# Altium schematic sheet MS.SchDoc
size E
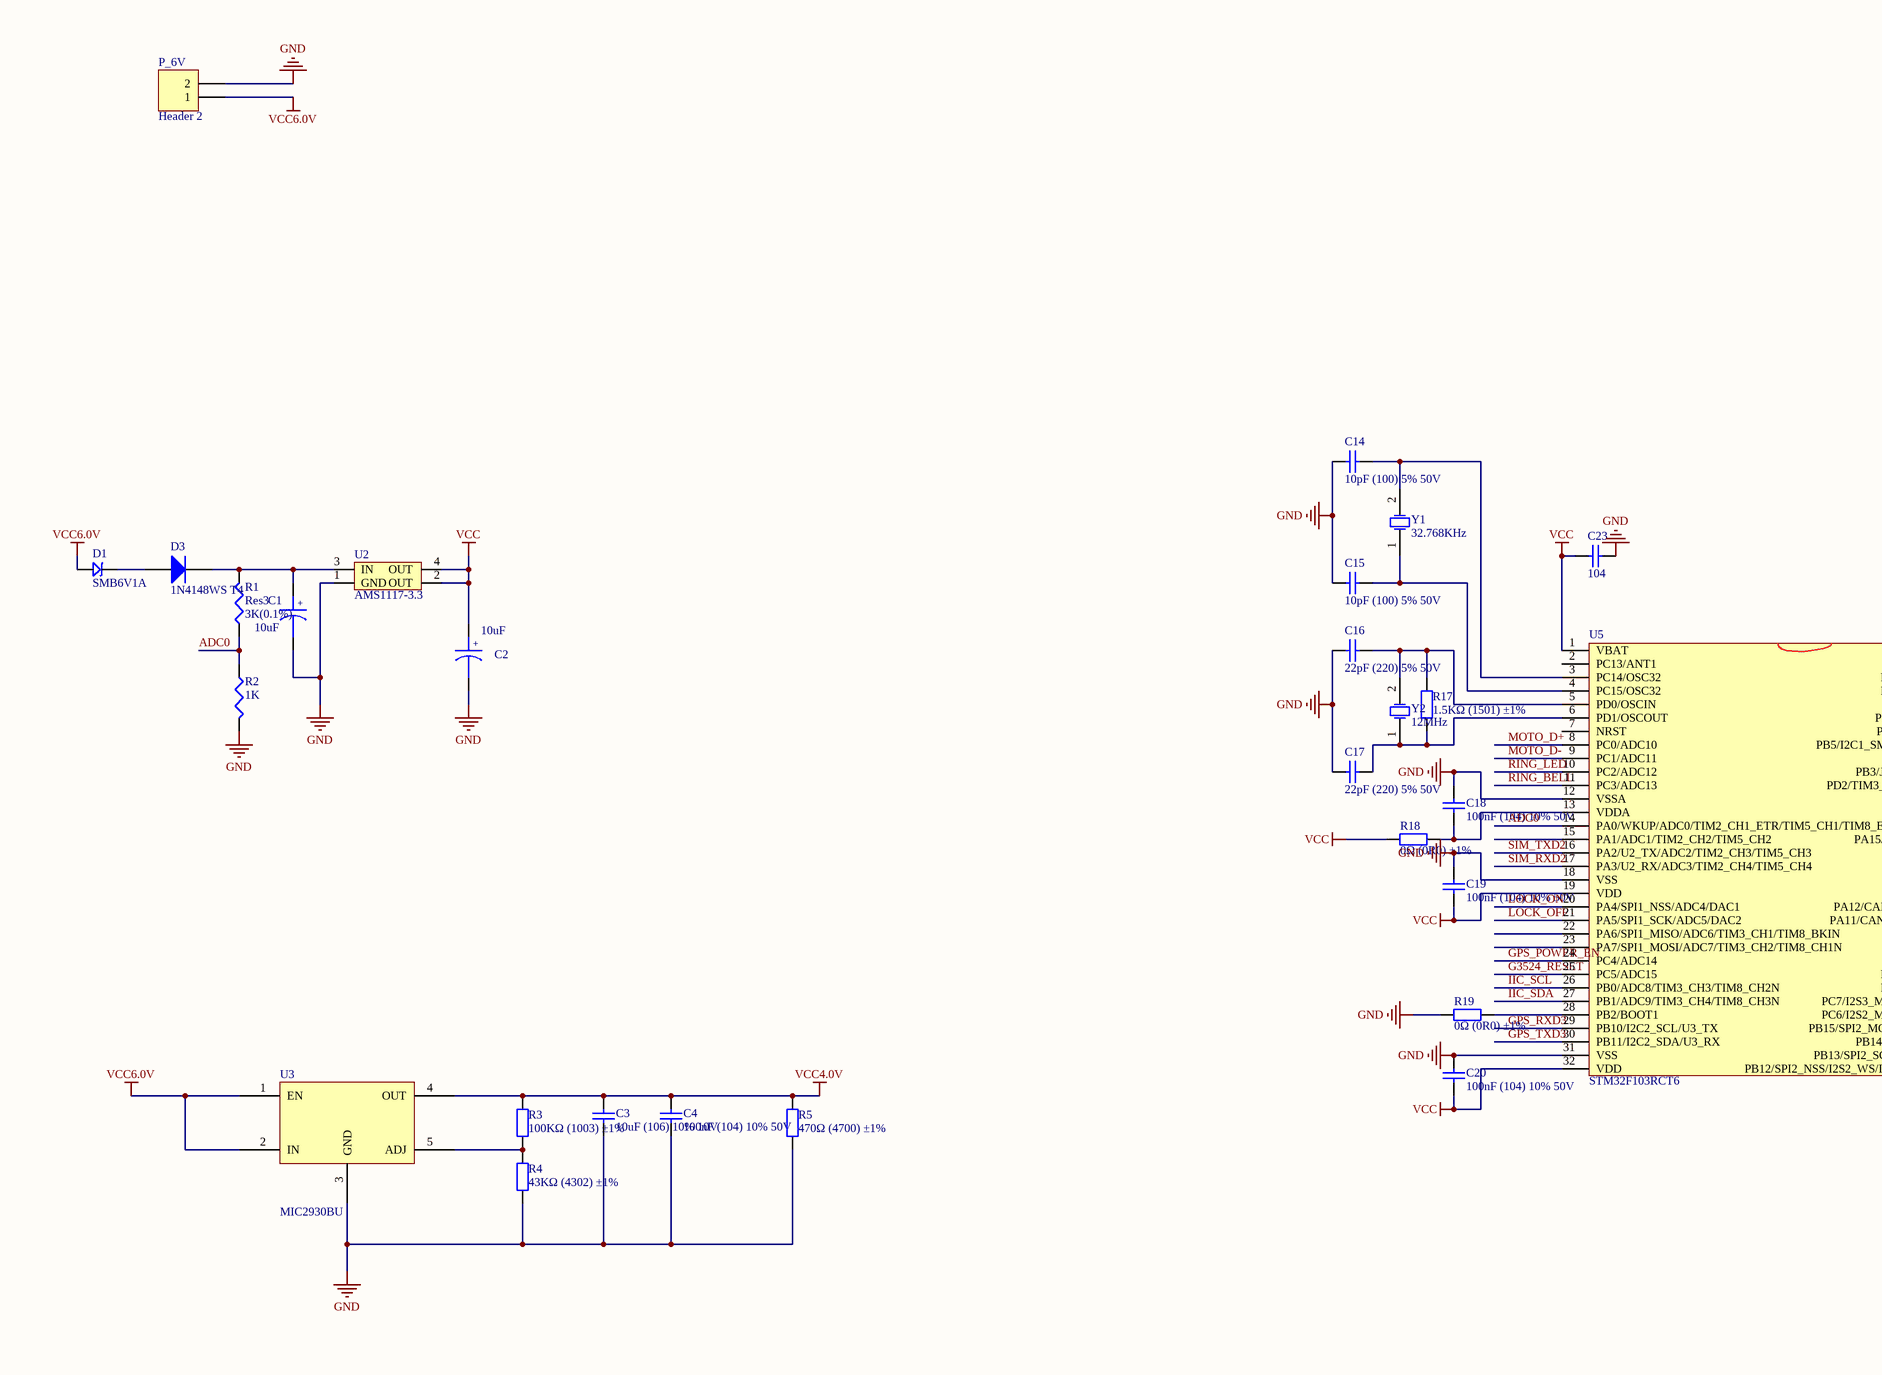
[diagram p0: MS.SchDoc, top left]
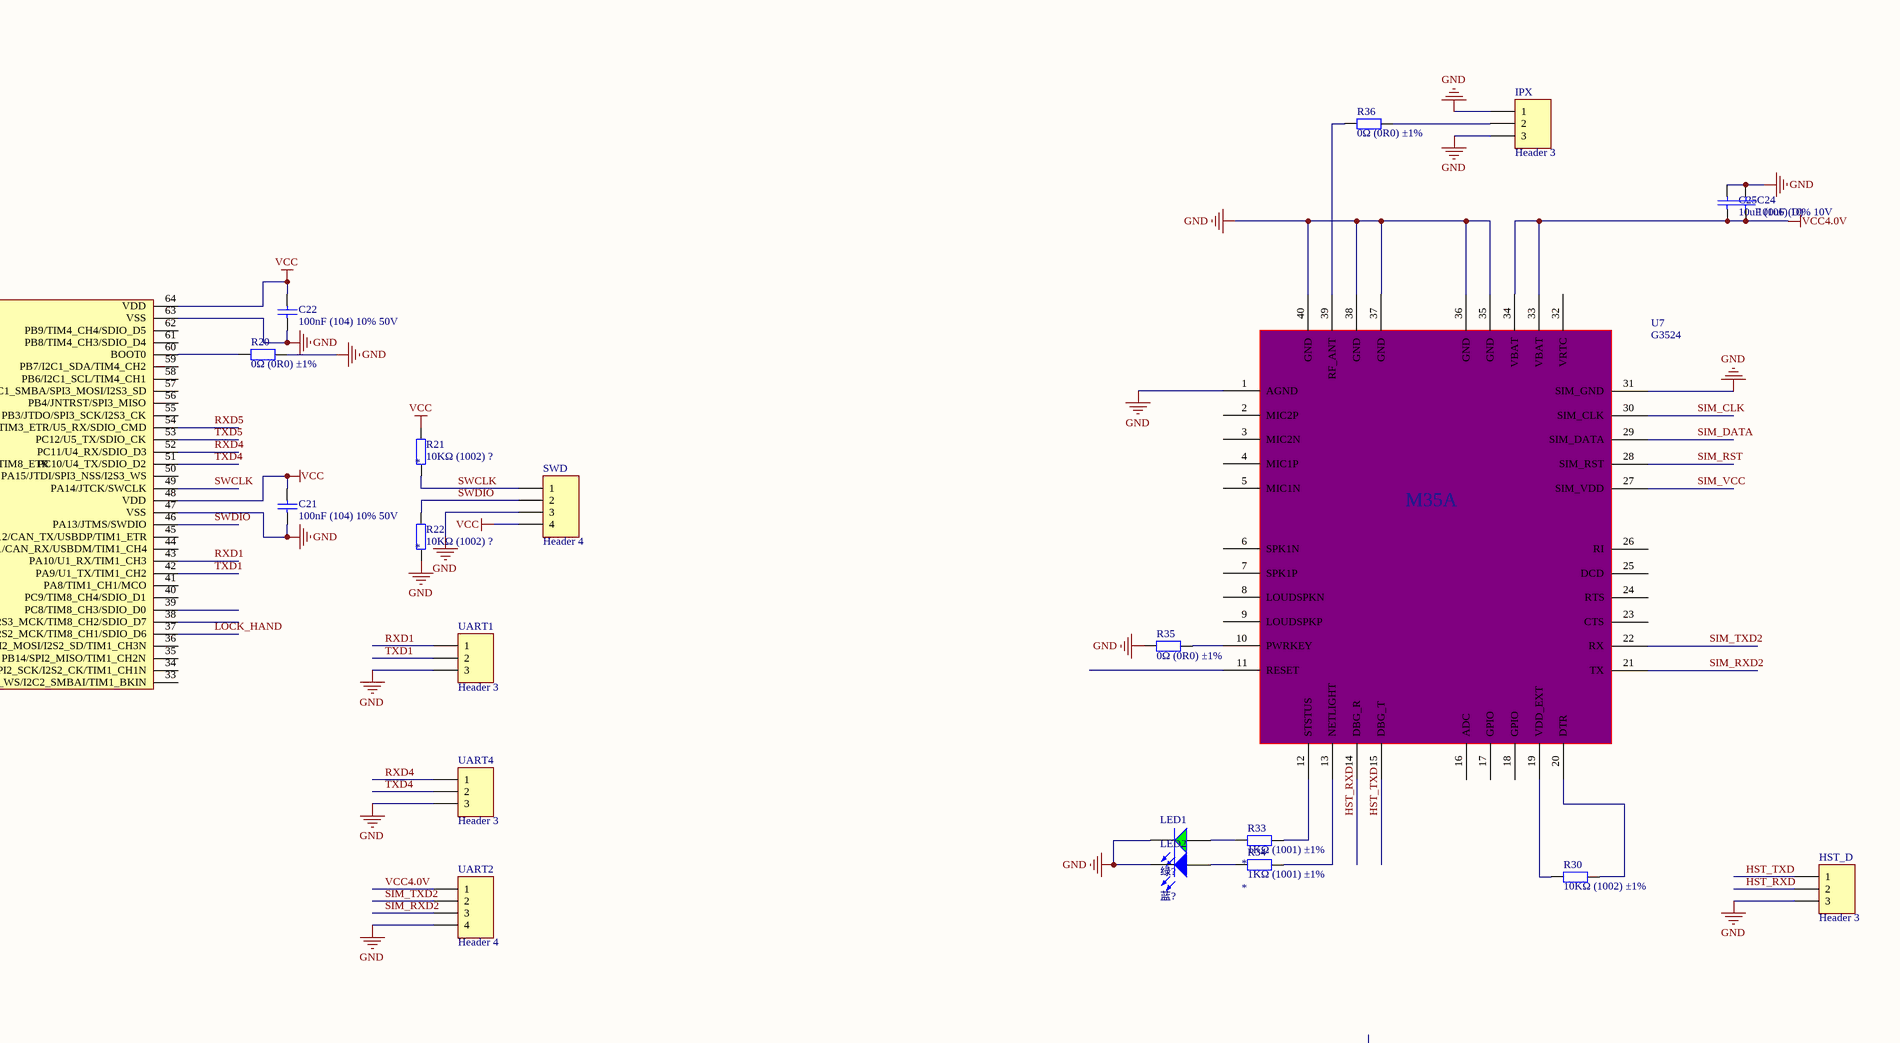
[diagram p1: MS.SchDoc, top right]
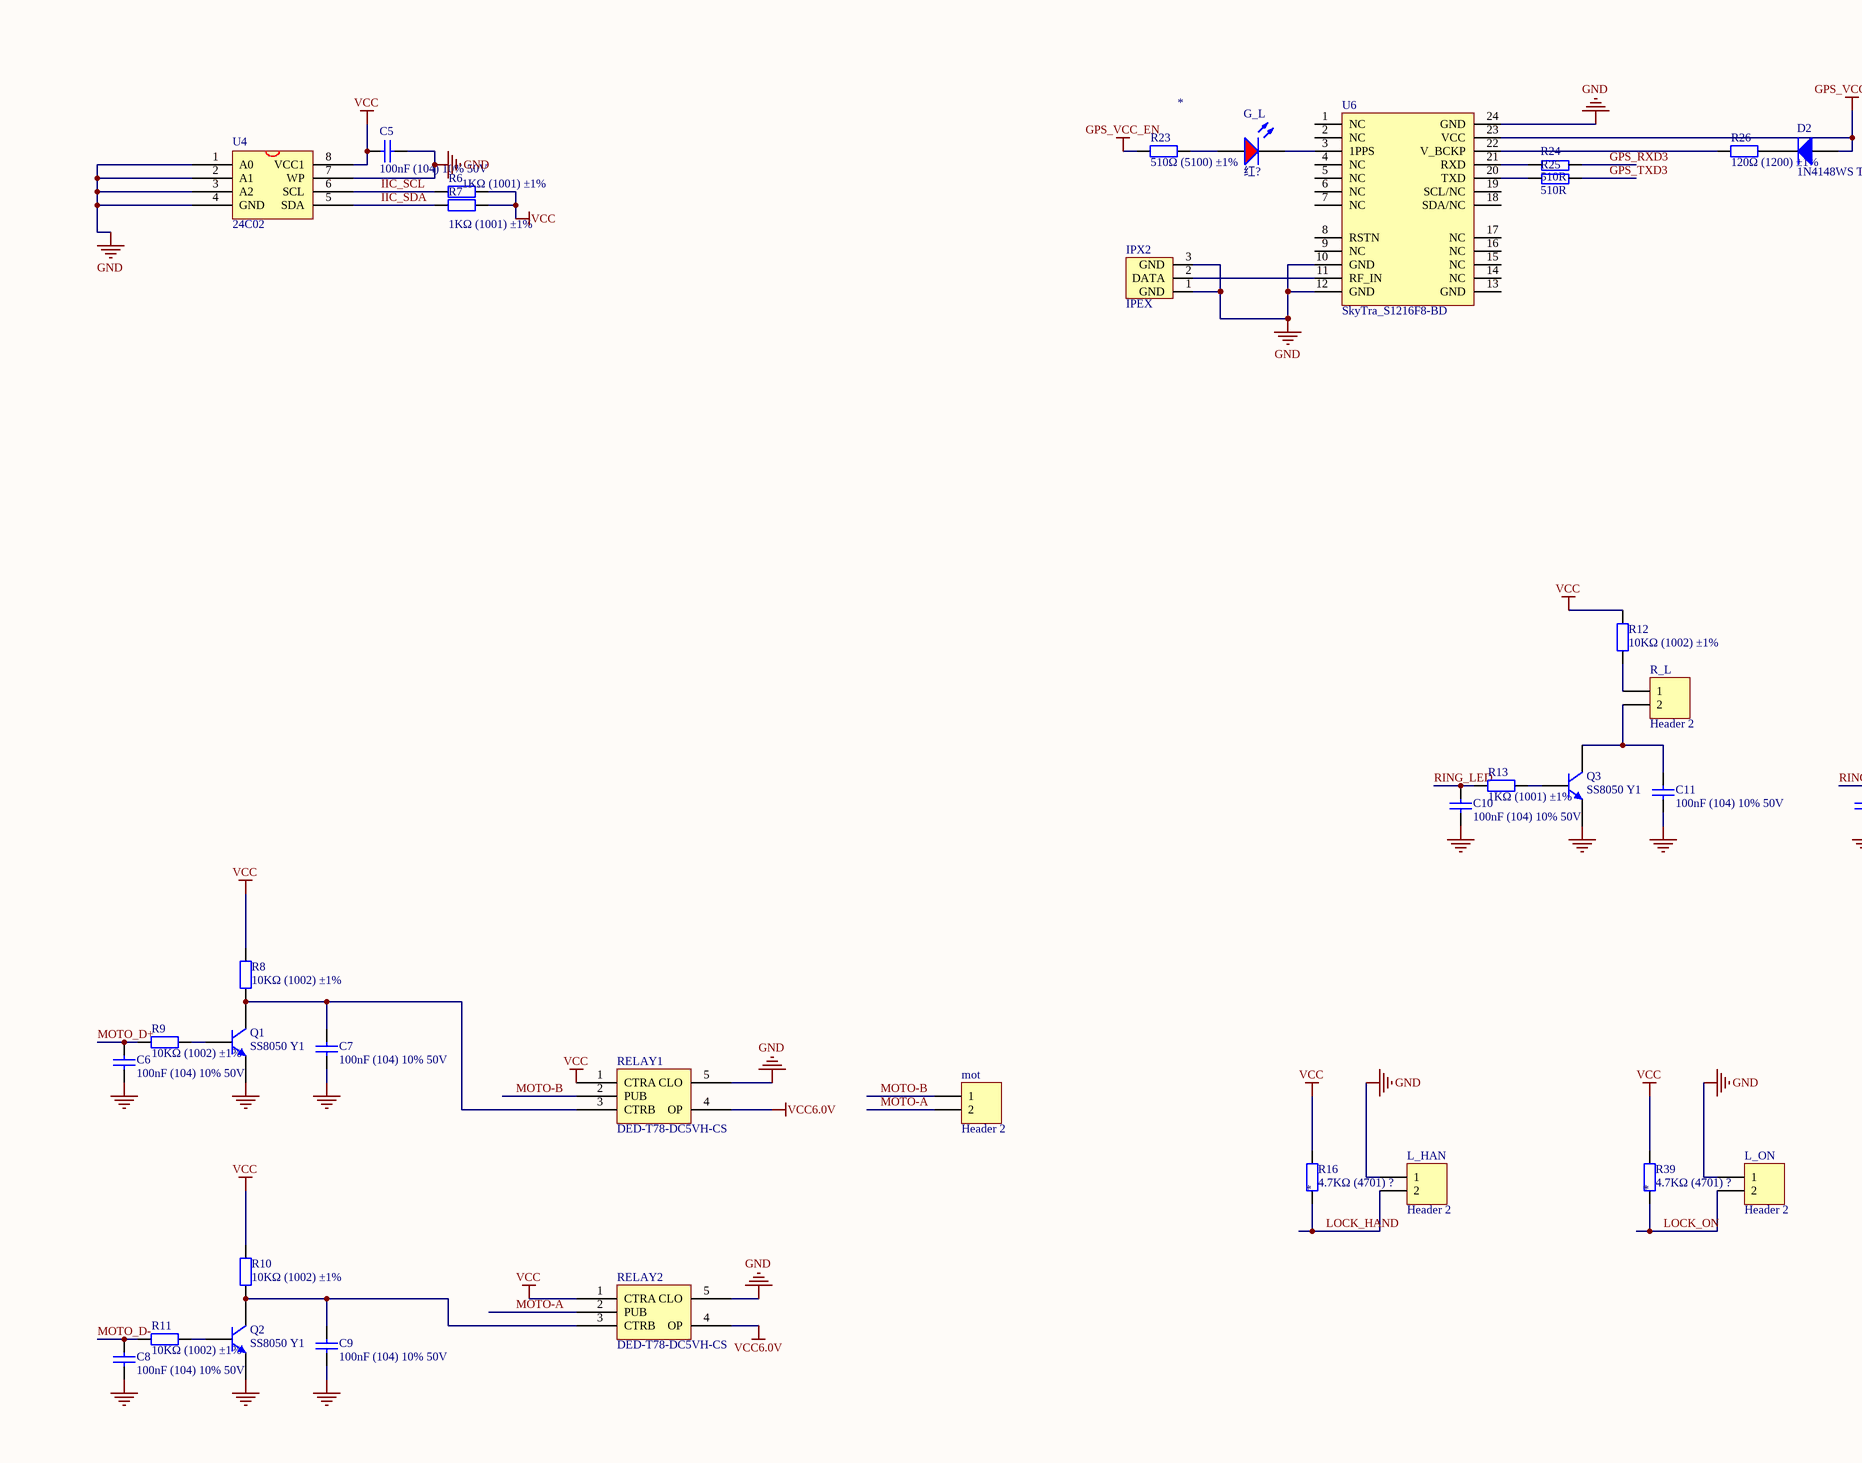
[diagram p2: MS.SchDoc, bottom left]
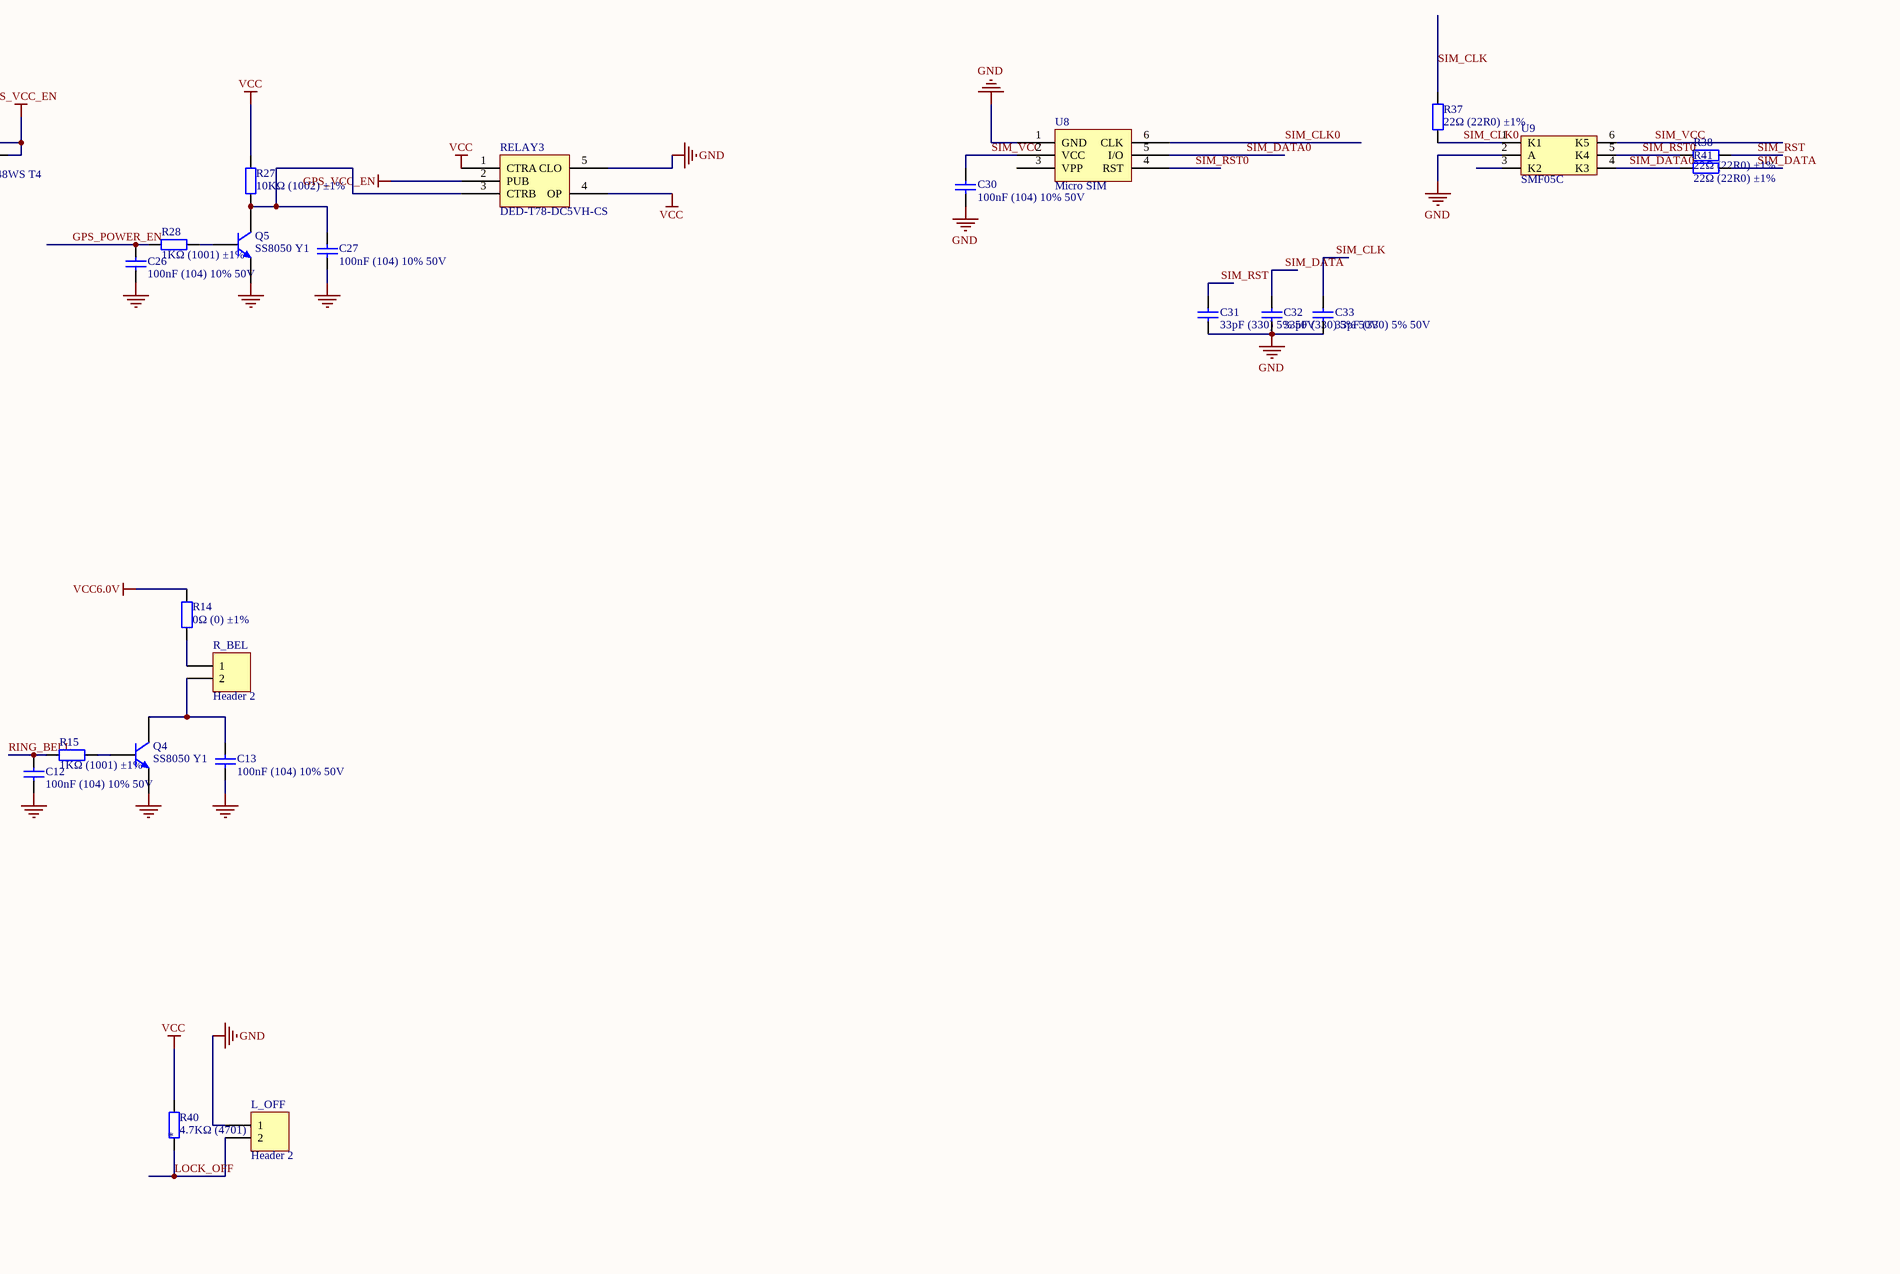
[diagram p3: MS.SchDoc, bottom right]

## Parts
C1  10uF  [TANCAP]
C2  10uF  [TANCAP]
C3  10uF (106) 10% 10V  [0603_C]
C4  100nF (104) 10% 50V  [0603_C]
C5  100nF (104) 10% 50V  [0603_C]
C6  100nF (104) 10% 50V  [0603_C]
C7  100nF (104) 10% 50V  [0603_C]
C8  100nF (104) 10% 50V  [0603_C]
C9  100nF (104) 10% 50V  [0603_C]
C10  100nF (104) 10% 50V  [0603_C]
C11  100nF (104) 10% 50V  [0603_C]
C12  100nF (104) 10% 50V  [0603_C]
C13  100nF (104) 10% 50V  [0603_C]
C14  10pF (100) 5% 50V  [0603_C]
C15  10pF (100) 5% 50V  [0603_C]
C16  22pF (220) 5% 50V  [0603_C]
C17  22pF (220) 5% 50V  [0603_C]
C18  100nF (104) 10% 50V  [0603_C]
C19  100nF (104) 10% 50V  [0603_C]
C20  100nF (104) 10% 50V  [0603_C]
C21  100nF (104) 10% 50V  [0603_C]
C22  100nF (104) 10% 50V  [0603_C]
C23  104  [0603_C]
C24  100uF (D)  [7343]
C25  10uF (106) 10% 10V  [TanCap]
C26  100nF (104) 10% 50V  [0603_C]
C27  100nF (104) 10% 50V  [0603_C]
C30  100nF (104) 10% 50V  [0603_C]
C31  33pF (330) 5% 50V  [0603_C]
C32  33pF (330) 5% 50V  [0603_C]
C33  33pF (330) 5% 50V  [0603_C]
D1  SMB6V1A  [1206]
D2  1N4148WS T4  [SOD-323]
D3  1N4148WS T4  [SOD-323]
G_L  *  [0603_LED_S1]
HST_D  Header 3  [HDR1X3]
IPX  Header 3  [IPX]
IPX2  IPEX  [IPEX]
L_HAN  Header 2  [COM2]
L_OFF  Header 2  [COM2]
L_ON  Header 2  [COM2]
LED1  *  [0603_LED_S1]
LED2  *  [0603_LED_S1]
mot  Header 2  [COM2]
P_6V  Header 2  [HEAD2L-0.8]
Q1  SS8050 Y1  [SOT-23(SOT-23-3)]
Q2  SS8050 Y1  [SOT-23(SOT-23-3)]
Q3  SS8050 Y1  [SOT-23(SOT-23-3)]
Q4  SS8050 Y1  [SOT-23(SOT-23-3)]
Q5  SS8050 Y1  [SOT-23(SOT-23-3)]
R1  Res3  value 3K(0.1%)  [AXIAL-0.3]
R2  1K  [AXIAL-0.3]
R3  100KΩ (1003) ±1%  [0603_R]
R4  43KΩ (4302) ±1%  [0603_R]
R5  470Ω (4700) ±1%  [0603_R]
R6  1KΩ (1001) ±1%  [0603_R]
R7  1KΩ (1001) ±1%  [0603_R]
R8  10KΩ (1002) ±1%  [0603_R]
R9  10KΩ (1002) ±1%  [0603_R]
R10  10KΩ (1002) ±1%  [0603_R]
R11  10KΩ (1002) ±1%  [0603_R]
R12  10KΩ (1002) ±1%  [0603_R]
R13  1KΩ (1001) ±1%  [0603_R]
R14  0Ω (0) ±1%  [0603_R]
R15  1KΩ (1001) ±1%  [0603_R]
R16  *  [0603_R]
R17  1.5KΩ (1501) ±1%  [0603_R]
R18  0Ω (0R0) ±1%  [0603_R]
R19  0Ω (0R0) ±1%  [0603_R]
R20  0Ω (0R0) ±1%  [0603_R]
R21  *  [0603_R]
R22  *  [0603_R]
R23  510Ω (5100) ±1%  [0603_R]
R24  510R  [0603_R]
R25  510R  [0603_R]
R26  120Ω (1200) ±1%  [0603_R]
R27  10KΩ (1002) ±1%  [0603_R]
R28  1KΩ (1001) ±1%  [0603_R]
R30  10KΩ (1002) ±1%  [0603_R]
R33  1KΩ (1001) ±1%  [0603_R]
R34  1KΩ (1001) ±1%  [0603_R]
R35  0Ω (0R0) ±1%  [0603_R]
R36  0Ω (0R0) ±1%  [0603_R]
R37  22Ω (22R0) ±1%  [0603_R]
R38  22Ω (22R0) ±1%  [0603_R]
R39  *  [0603_R]
R40  *  [0603_R]
R41  22Ω (22R0) ±1%  [0603_R]
R_BEL  Header 2  [COM2]
R_L  Header 2  [COM2]
RELAY1  DED-T78-DC5VH-CS  [SRA-05VDC-CL]
RELAY2  DED-T78-DC5VH-CS  [SRA-05VDC-CL]
RELAY3  DED-T78-DC5VH-CS  [SRA-05VDC-CL]
SWD  Header 4  [HDR1X4]
U2  AMS1117-3.3  [AMS1117]
U3  MIC2930BU
U4  24C02  [SOP-8]
U5  STM32F103RCT6  [LC-LQFP-64_10x10x05P]
U6  SkyTra_S1216F8-BD  [GPS_NEO-6]
U7  G3524  [PCBComponent_1]
U8  Micro SIM  [Micro SIM]
U9  SMF05C  [SMF05C]
UART1  Header 3  [HDR1X3]
UART2  Header 4  [HDR1X4]
UART4  Header 3  [HDR1X3]
Y1  32.768KHz  [XTAL32]
Y2  12MHz  [XTAL_US]

## Nets
GND: C1.2 C2.2 C3.1 C4.1 C5.2 C6.1 C7.1 C8.1 C9.1 C10.1 C11.1 C12.1 C13.1 C14.1 C15.1 C16.1 C17.1 C18.1 C19.1 C20.1 C21.2 C22.1 C23.1 C24.2 C25.2 C26.1 C27.1 C30.1 C31.1 C32.1 C33.1 HST_D.3 IPX.1 IPX.3 IPX2.1(GND) IPX2.3(GND) L_HAN.1 L_OFF.1 L_ON.1 LED1.K LED2.K P_6V.2 Q1.2(E) Q2.2(E) Q3.2(E) Q4.2(E) Q5.2(E) R2.2 R4.1 R5.1 R19.1 R20.2 R22.1 R35.2 RELAY1.5(CLO) RELAY2.5(CLO) RELAY3.5(CLO) SWD.3 U2.1(GND) U3.3(GND) U4.1(A0) U4.2(A1) U4.3(A2) U4.4(GND) U4.7(WP) U5.12(VSSA) U5.18(VSS) U5.31(VSS) U5.47(VSS) U5.63(VSS) U6.10(GND) U6.12(GND) U6.24(GND) U7.1(AGND) U7.31(SIM_GND) U7.35(GND) U7.36(GND) U7.37(GND) U7.38(GND) U7.40(GND) U8.1(GND) U9.2(A) UART1.3 UART2.4 UART4.3
GPS_VCC_EN: D2.1(A) R23.1 RELAY3.2(PUB) U6.23(VCC)
VCC: C2.1 C5.1 C19.2 C20.2 C21.1 C22.2 C23.2 R6.2 R7.2 R8.2 R10.2 R12.2 R16.2 R18.1 R21.2 R27.2 R39.2 R40.2 RELAY1.1(CTRA) RELAY2.1(CTRA) RELAY3.1(CTRA) RELAY3.4(OP) SWD.4 U2.2(OUT) U2.4(OUT) U4.8(VCC1) U5.1(VBAT) U5.19(VDD) U5.32(VDD) U5.48(VDD) U5.64(VDD)
VCC4.0V: C3.2 C4.2 C24.1 C25.1 R3.2 R5.2 U3.4(OUT) U7.33(VBAT) U7.34(VBAT) UART2.1
VCC6.0V: D1.1 P_6V.1 R14.2 RELAY1.4(OP) RELAY2.4(OP) U3.1(EN) U3.2(IN)
ADC0: R1.1 R2.1 U5.14(PA0/WKUP/ADC0/TIM2_CH1_ETR/TIM5_CH1/TIM8_ETR)
G3524_RESET: U5.25(PC5/ADC15)
GPS_POWER_EN: C26.2 R28.1 U5.24(PC4/ADC14)
GPS_RXD3: R24.2 U5.29(PB10/I2C2_SCL/U3_TX)
GPS_TXD3: R25.2 U5.30(PB11/I2C2_SDA/U3_RX)
HST_RXD: HST_D.2 U7.14(DBG_R)
HST_TXD: HST_D.1 U7.15(DBG_T)
IIC_SCL: R6.1 U4.6(SCL) U5.26(PB0/ADC8/TIM3_CH3/TIM8_CH2N)
IIC_SDA: R7.1 U4.5(SDA) U5.27(PB1/ADC9/TIM3_CH4/TIM8_CH3N)
LOCK_HAND: L_HAN.2 R16.1 U5.37(PC6/I2S2_MCK/TIM8_CH1/SDIO_D6)
LOCK_OFF: L_OFF.2 R40.1 U5.21(PA5/SPI1_SCK/ADC5/DAC2)
LOCK_ON: L_ON.2 R39.1 U5.20(PA4/SPI1_NSS/ADC4/DAC1)
MOTO-A: mot.2 RELAY2.2(PUB)
MOTO-B: mot.1 RELAY1.2(PUB)
MOTO_D+: C6.2 R9.1 U5.8(PC0/ADC10)
MOTO_D-: C8.2 R11.1 U5.9(PC1/ADC11)
RING_BELL: C12.2 R15.1 U5.11(PC3/ADC13)
RING_LED: C10.2 R13.1 U5.10(PC2/ADC12)
RXD1: U5.43(PA10/U1_RX/TIM1_CH3) UART1.1
RXD4: U5.52(PC11/U4_RX/SDIO_D3) UART4.1
RXD5: U5.54(PD2/TIM3_ETR/U5_RX/SDIO_CMD)
SIM_CLK: C33.2 R37.2 U7.30(SIM_CLK)
SIM_CLK0: R37.1 U8.6(CLK) U9.1(K1)
SIM_DATA: C32.2 R41.2 U7.29(SIM_DATA)
SIM_DATA0: R41.1 U8.5(I/O) U9.4(K3)
SIM_RST: C31.2 R38.2 U7.28(SIM_RST)
SIM_RST0: R38.1 U8.4(RST) U9.5(K4)
SIM_RXD2: U5.17(PA3/U2_RX/ADC3/TIM2_CH4/TIM5_CH4) U7.21(TX) UART2.3
SIM_TXD2: U5.16(PA2/U2_TX/ADC2/TIM2_CH3/TIM5_CH3) U7.22(RX) UART2.2
SIM_VCC: C30.2 U7.27(SIM_VDD) U8.2(VCC) U9.6(K5)
SWCLK: R21.1 SWD.1 U5.49(PA14/JTCK/SWCLK)
SWDIO: R22.2 SWD.2 U5.46(PA13/JTMS/SWDIO)
TXD1: U5.42(PA9/U1_TX/TIM1_CH2) UART1.2
TXD4: U5.51(PC10/U4_TX/SDIO_D2) UART4.2
TXD5: U5.53(PC12/U5_TX/SDIO_CK)
NetC1_1: C1.1 D3.2(K) R1.2 U2.3(IN)
NetC7_2: C7.2 Q1.3(C) R8.1 RELAY1.3(CTRB)
NetC9_2: C9.2 Q2.3(C) R10.1 RELAY2.3(CTRB)
NetC11_2: C11.2 Q3.3(C) R_L.2
NetC13_2: C13.2 Q4.3(C) R_BEL.2
NetC14_2: C14.2 U5.3(PC14/OSC32) Y1.2(OSC2)
NetC15_2: C15.2 U5.4(PC15/OSC32) Y1.1(OSC1)
NetC16_2: C16.2 R17.2 U5.5(PD0/OSCIN) Y2.2(OSC2)
NetC17_2: C17.2 R17.1 U5.6(PD1/OSCOUT) Y2.1(OSC1)
NetC18_2: C18.2 R18.2 U5.13(VDDA)
NetC27_2: C27.2 Q5.3(C) R27.1 RELAY3.3(CTRB)
NetD1_2: D1.2 D3.1(A)
NetD2_2: D2.2(K) R26.2
NetG_L_A: G_L.A R23.2
NetG_L_K: G_L.K U6.3(1PPS)
NetIPX2_2: IPX2.2(DATA) U6.11(RF_IN)
NetIPX_2: IPX.2 R36.2
NetLED1_A: LED1.A R33.1
NetLED2_A: LED2.A R34.1
NetQ1_1: Q1.1(B) R9.2
NetQ2_1: Q2.1(B) R11.2
NetQ3_1: Q3.1(B) R13.2
NetQ4_1: Q4.1(B) R15.2
NetQ5_1: Q5.1(B) R28.2
NetR3_1: R3.1 R4.2 U3.5(ADJ)
NetR12_1: R12.1 R_L.1
NetR14_1: R14.1 R_BEL.1
NetR19_2: R19.2 U5.28(PB2/BOOT1)
NetR20_1: R20.1 U5.60(BOOT0)
NetR24_1: R24.1 U6.21(RXD)
NetR25_1: R25.1 U6.20(TXD)
NetR26_1: R26.1 U6.22(V_BCKP)
NetR30_1: R30.1 U7.19(VDD_EXT)
NetR30_2: R30.2 U7.20(DTR)
NetR33_2: R33.2 U7.12(STSTUS)
NetR34_2: R34.2 U7.13(NETLIGHT)
NetR35_1: R35.1 U7.10(PWRKEY)
NetR36_1: R36.1 U7.39(RF_ANT)

Not connected (* = marked no-connect by the designer): U5 2(PC13/ANT1) 7(NRST) 15(PA1/ADC1/TIM2_CH2/TIM5_CH2) 22(PA6/SPI1_MISO/ADC6/TIM3_CH1/TIM8_BKIN) 23(PA7/SPI1_MOSI/ADC7/TIM3_CH2/TIM8_CH1N) 33(PB12/SPI2_NSS/I2S2_WS/I2C2_SMBAI/TIM1_BKIN) 34(PB13/SPI2_SCK/I2S2_CK/TIM1_CH1N) 35(PB14/SPI2_MISO/TIM1_CH2N) 36(PB15/SPI2_MOSI/I2S2_SD/TIM1_CH3N) 38(PC7/I2S3_MCK/TIM8_CH2/SDIO_D7) 39(PC8/TIM8_CH3/SDIO_D0) 40(PC9/TIM8_CH4/SDIO_D1) 41(PA8/TIM1_CH1/MCO) 44(PA11/CAN_RX/USBDM/TIM1_CH4) 45(PA12/CAN_TX/USBDP/TIM1_ETR) 50(PA15/JTDI/SPI3_NSS/I2S3_WS) 55(PB3/JTDO/SPI3_SCK/I2S3_CK) 56(PB4/JNTRST/SPI3_MISO) 57(PB5/I2C1_SMBA/SPI3_MOSI/I2S3_SD) 58(PB6/I2C1_SCL/TIM4_CH1) 59(PB7/I2C1_SDA/TIM4_CH2) 61(PB8/TIM4_CH3/SDIO_D4) 62(PB9/TIM4_CH4/SDIO_D5); U6 1(NC) 2(NC) 4(NC) 5(NC) 6(NC) 7(NC) 8(RSTN) 9(NC) 13(GND) 14(NC) 15(NC) 16(NC) 17(NC) 18(SDA/NC) 19(SCL/NC); U7 2(MIC2P) 3(MIC2N) 4(MIC1P) 5(MIC1N) 6(SPK1N) 7(SPK1P) 8(LOUDSPKN) 9(LOUDSPKP) 11(RESET) 16(ADC) 17(GPIO) 18(GPIO) 23(CTS) 24(RTS) 25(DCD) 26(RI) 32(VRTC); U8 3(VPP); U9 3(K2)

## Notes on the sheet
- (in symbol 0) 红?
- (in symbol 0603 4.7KΩ) 4.7KΩ (4701) ?
- (in symbol 0603 10KΩ (1002) 1%) 10KΩ (1002) ?
- (in symbol 0603 绿灯) 绿?
- (in symbol 0603 蓝灯) 蓝?
- (in symbol CAPACITOR POL) +
- (in symbol Component_1) M35A

## Library data of the parts
C1 C2 = CAPACITOR POL: Capacitor
C3 = 0603 10uF (106) : 贴片电容; ComponentLink1URL: http://www.szlcsc.com/product/details_20411.html; Package: 0603; Supplier: LC; SuppliersPartNumber: C19702; ComponentLink1Description: 供应商链接
C4-C13 C18-C22 C26 C27 = 0603 100nF (104) : 贴片电容; ComponentLink1URL: http://www.szlcsc.com/product/details_15331.html; Package: 0603; Supplier: LC; SuppliersPartNumber: C14663; ComponentLink1Description: 供应商链接
C14 C15 = 0603 10pF (100): 贴片电容; ComponentLink1Description: 供应商链接; ComponentLink1URL: http://www.szlcsc.com/product/details_1986.html; Package: 0603; Supplier: LC; SuppliersPartNumber: C1634
C16 C17 = 0603 22pF (220): 贴片电容; ComponentLink1Description: 供应商链接; ComponentLink1URL: http://www.szlcsc.com/product/details_2005.html; Package: 0603; Supplier: LC; SuppliersPartNumber: C1653
C23 = 0805 1uF (105) 10% 50V: 贴片电容; ComponentLink1URL: http://www.szlcsc.com/product/details_29074.html; Package: 0805; Supplier: LC; SuppliersPartNumber: C28323
C24 = 0603 100nF (104) 10% 50V: 贴片电容; ComponentLink1URL: http://www.szlcsc.com/product/details_15331.html; Package: 0603; Supplier: LC; SuppliersPartNumber: C14663
C25 = 0603 10uF: 贴片电容; ComponentLink1URL: http://www.szlcsc.com/product/details_20411.html; Package: 0603; Supplier: LC; SuppliersPartNumber: C19702
C30 = 0603 100nF (1: 贴片电容; ComponentLink1URL: http://www.szlcsc.com/product/details_15331.html; Package: 0603; Supplier: LC; SuppliersPartNumber: C14663
C31-C33 = 0603 33pF (330): 贴片电容; ComponentLink1URL: http://www.szlcsc.com/product/details_2015.html; Package: 0603; Supplier: LC; SuppliersPartNumber: C1663; ComponentLink1Description: 供应商链接
D1 = SM: TVS
D2 D3 = SOD-323 : 二极管; ComponentLink1URL: http://www.szlcsc.com/product/details_2485.html; Package: SOD-323; Supplier: LC; SuppliersPartNumber: C2128
G_L = 0: 发光二极管; ComponentLink1URL: http://www.szlcsc.com/product/details_2659.html; Package: 0603; Supplier: LC; SuppliersPartNumber: C2286
HST_D IPX UART1 UART4 = Header 3: Header, 3-Pin; LatestRevisionDate: 17-Jul-2002; LatestRevisionNote: Re-released for DXP Platform.; Publisher: Altium Limited
IPX2 = IPEX: IPEX座
L_HAN L_OFF L_ON mot P_6V R_BEL R_L = Header 2: Header, 2-Pin; LatestRevisionDate: 17-Jul-2002; LatestRevisionNote: Re-released for DXP Platform.; Publisher: Altium Limited
LED1 = 0603 绿灯: 发光二极管; ComponentLink1URL: http://www.szlcsc.com/product/details_73152.html; Package: 0603; Supplier: LC; SuppliersPartNumber: C72043
LED2 = 0603 蓝灯: 发光二极管; ComponentLink1URL: http://www.szlcsc.com/product/details_73150.html; Package: 0603; Supplier: LC; SuppliersPartNumber: C72041
Q1-Q5 = SOT-23 : 三极管; ComponentLink1URL: http://www.szlcsc.com/product/details_2507.html; Package: SOT-23; Supplier: LC; SuppliersPartNumber: C2150
R1 R2 = Res3: Resistor; Published: 8-Jun-2000; LatestRevisionDate: 29-May-2009; LatestRevisionNote: IPC-7351 Footprint Added.; PackageReference: J1-0603; Publisher: Altium Limited; PackageDescription: Chip Resistor
R3 = 0603 100KΩ: 贴片电阻; ComponentLink1URL: http://www.szlcsc.com/product/details_26546.html; Package: 0603; Supplier: LC; SuppliersPartNumber: C25803; ComponentLink1Description: 供应商链接
R4 = 0603 43KΩ: 贴片电阻; ComponentLink1URL: http://www.szlcsc.com/product/details_23899.html; Package: 0603; Supplier: LC; SuppliersPartNumber: C23172; ComponentLink1Description: 供应商链接
R5 = 0603 470Ω: 贴片电阻; ComponentLink1URL: http://www.szlcsc.com/product/details_23906.html; Package: 0603; Supplier: LC; SuppliersPartNumber: C23179; ComponentLink1Description: 供应商链接
R6 R7 R13 R15 R28 R33 R34 = 0603 1KΩ: 贴片电阻; ComponentLink1Description: 供应商链接; ComponentLink1URL: http://www.szlcsc.com/product/details_21904.html; Package: 0603; Supplier: LC; SuppliersPartNumber: C21190
R8-R12 R14 R27 R30 = 0603 10KΩ: 贴片电阻; ComponentLink1Description: 供应商链接; ComponentLink1URL: http://www.szlcsc.com/product/details_26547.html; Package: 0603; Supplier: LC; SuppliersPartNumber: C25804
R16 R39 R40 = 0603 4.7KΩ: 贴片电阻; ComponentLink1URL: http://www.szlcsc.com/product/details_23889.html; Package: 0603; Supplier: LC; SuppliersPartNumber: C23162
R17 = 0603 1.5KΩ: 贴片电阻; ComponentLink1Description: 供应商链接; ComponentLink1URL: http://www.szlcsc.com/product/details_23570.html; Package: 0603; Supplier: LC; SuppliersPartNumber: C22843
R18-R20 R35 R36 = 0603 0|: 贴片电阻; ComponentLink1URL: http://www.szlcsc.com/product/details_21903.html; Package: 0603; Supplier: LC; SuppliersPartNumber: C21189; ComponentLink1Description: 供应商链接
R21 R22 = 0603 10KΩ (1002) 1%: 贴片电阻; ComponentLink1URL: http://www.szlcsc.com/product/details_26547.html; Package: 0603; Supplier: LC; SuppliersPartNumber: C25804
R23 = 0603 510Ω: 贴片电阻; ComponentLink1Description: 供应商链接; ComponentLink1URL: http://www.szlcsc.com/product/details_23920.html; Package: 0603; Supplier: LC; SuppliersPartNumber: C23193
R24 R25 = R
R26 = 0603 120Ω: 贴片电阻; ComponentLink1Description: 供应商链接; ComponentLink1URL: http://www.szlcsc.com/product/details_23514.html; Package: 0603; Supplier: LC; SuppliersPartNumber: C22787
R37 R38 R41 = 0603 22Ω: 贴片电阻; ComponentLink1URL: http://www.szlcsc.com/product/details_24078.html; Package: 0603; Supplier: LC; SuppliersPartNumber: C23345; ComponentLink1Description: 供应商链接
SWD UART2 = Header 4: Header, 4-Pin; LatestRevisionDate: 17-Jul-2002; LatestRevisionNote: Re-released for DXP Platform.; Publisher: Altium Limited
U2 = AMS1117
U4 = 24C256
U5 = STM
U6 = SkyTra_GPS
U7 = Component_1
U9 = SMF05C: TVS
Y1 Y2 = XTAL: Crystal Oscillator; Published: 8-Jun-2000; LatestRevisionDate: 17-Jul-2002; LatestRevisionNote: Re-released for DXP Platform.; Publisher: Altium Limited